# EAGLE design test_stmsize_long (EAGLE 6.6.0)
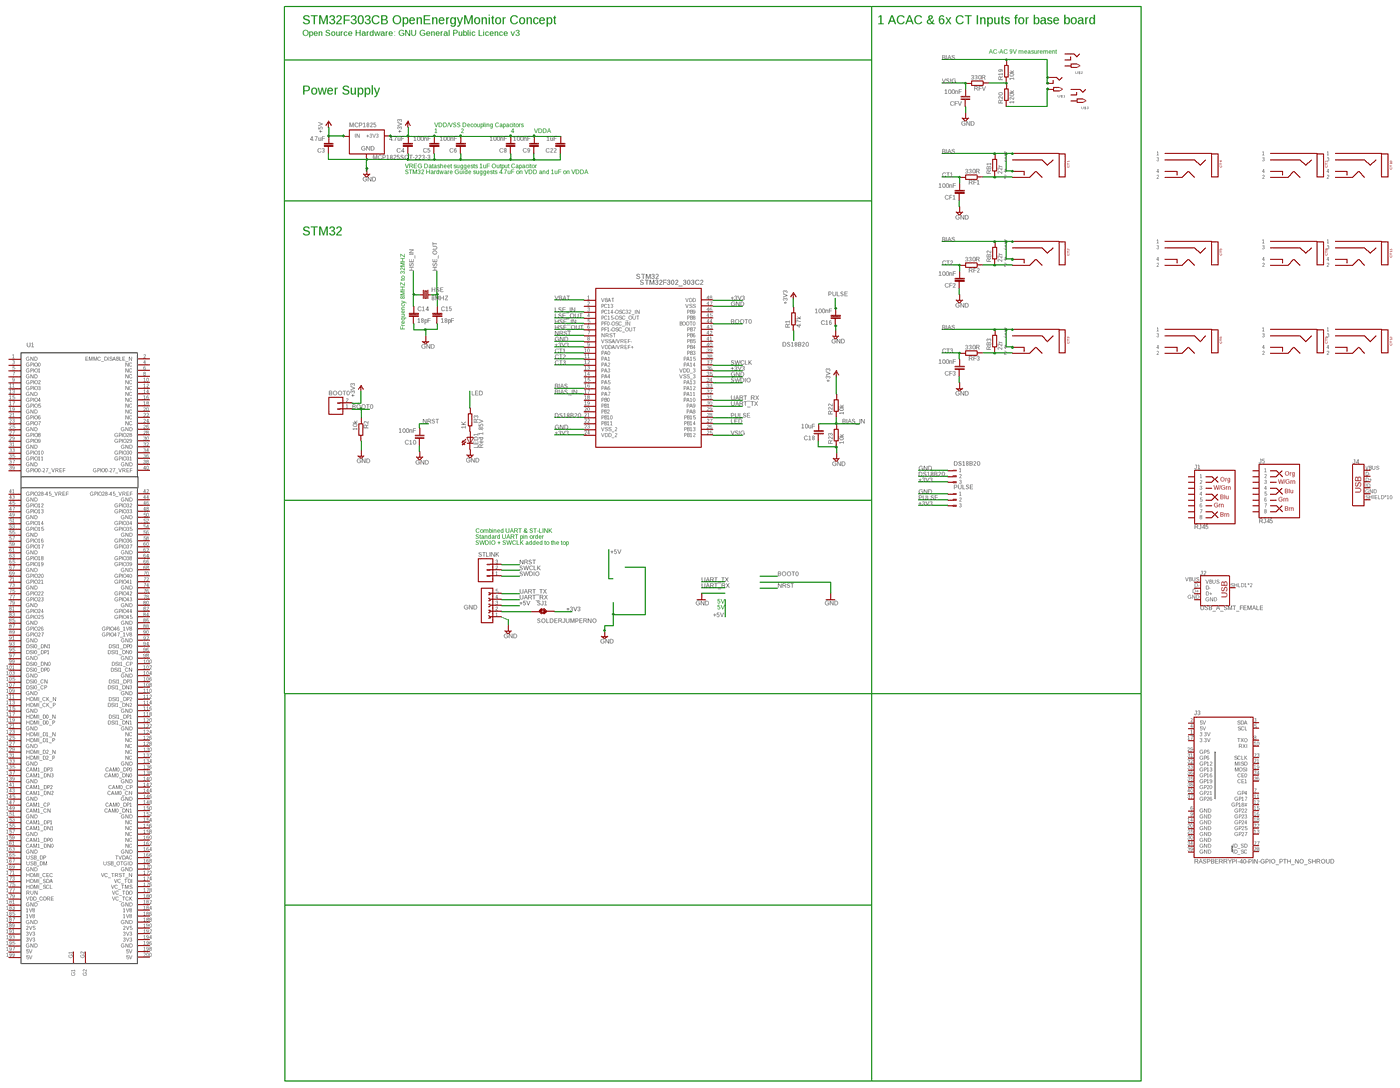
[diagram p0: schematic, sheet 1, overview]
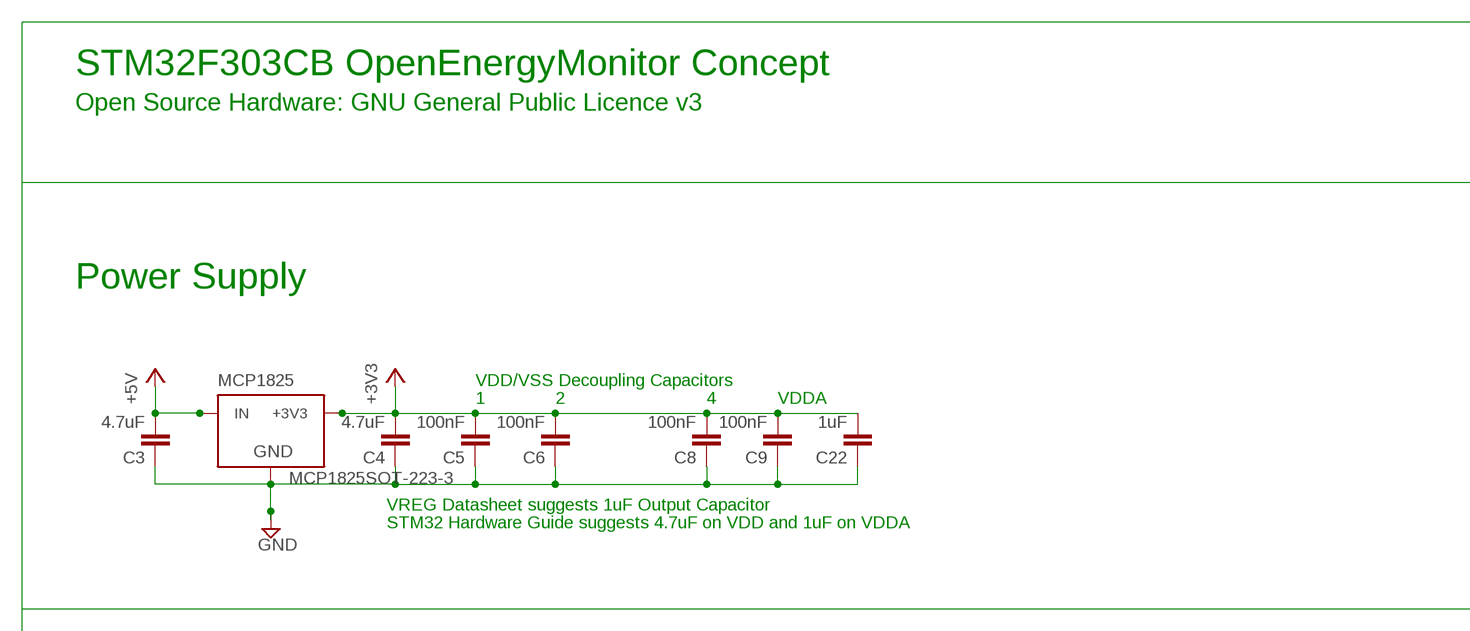
[diagram p1: schematic, sheet 1, part 1 of 4]
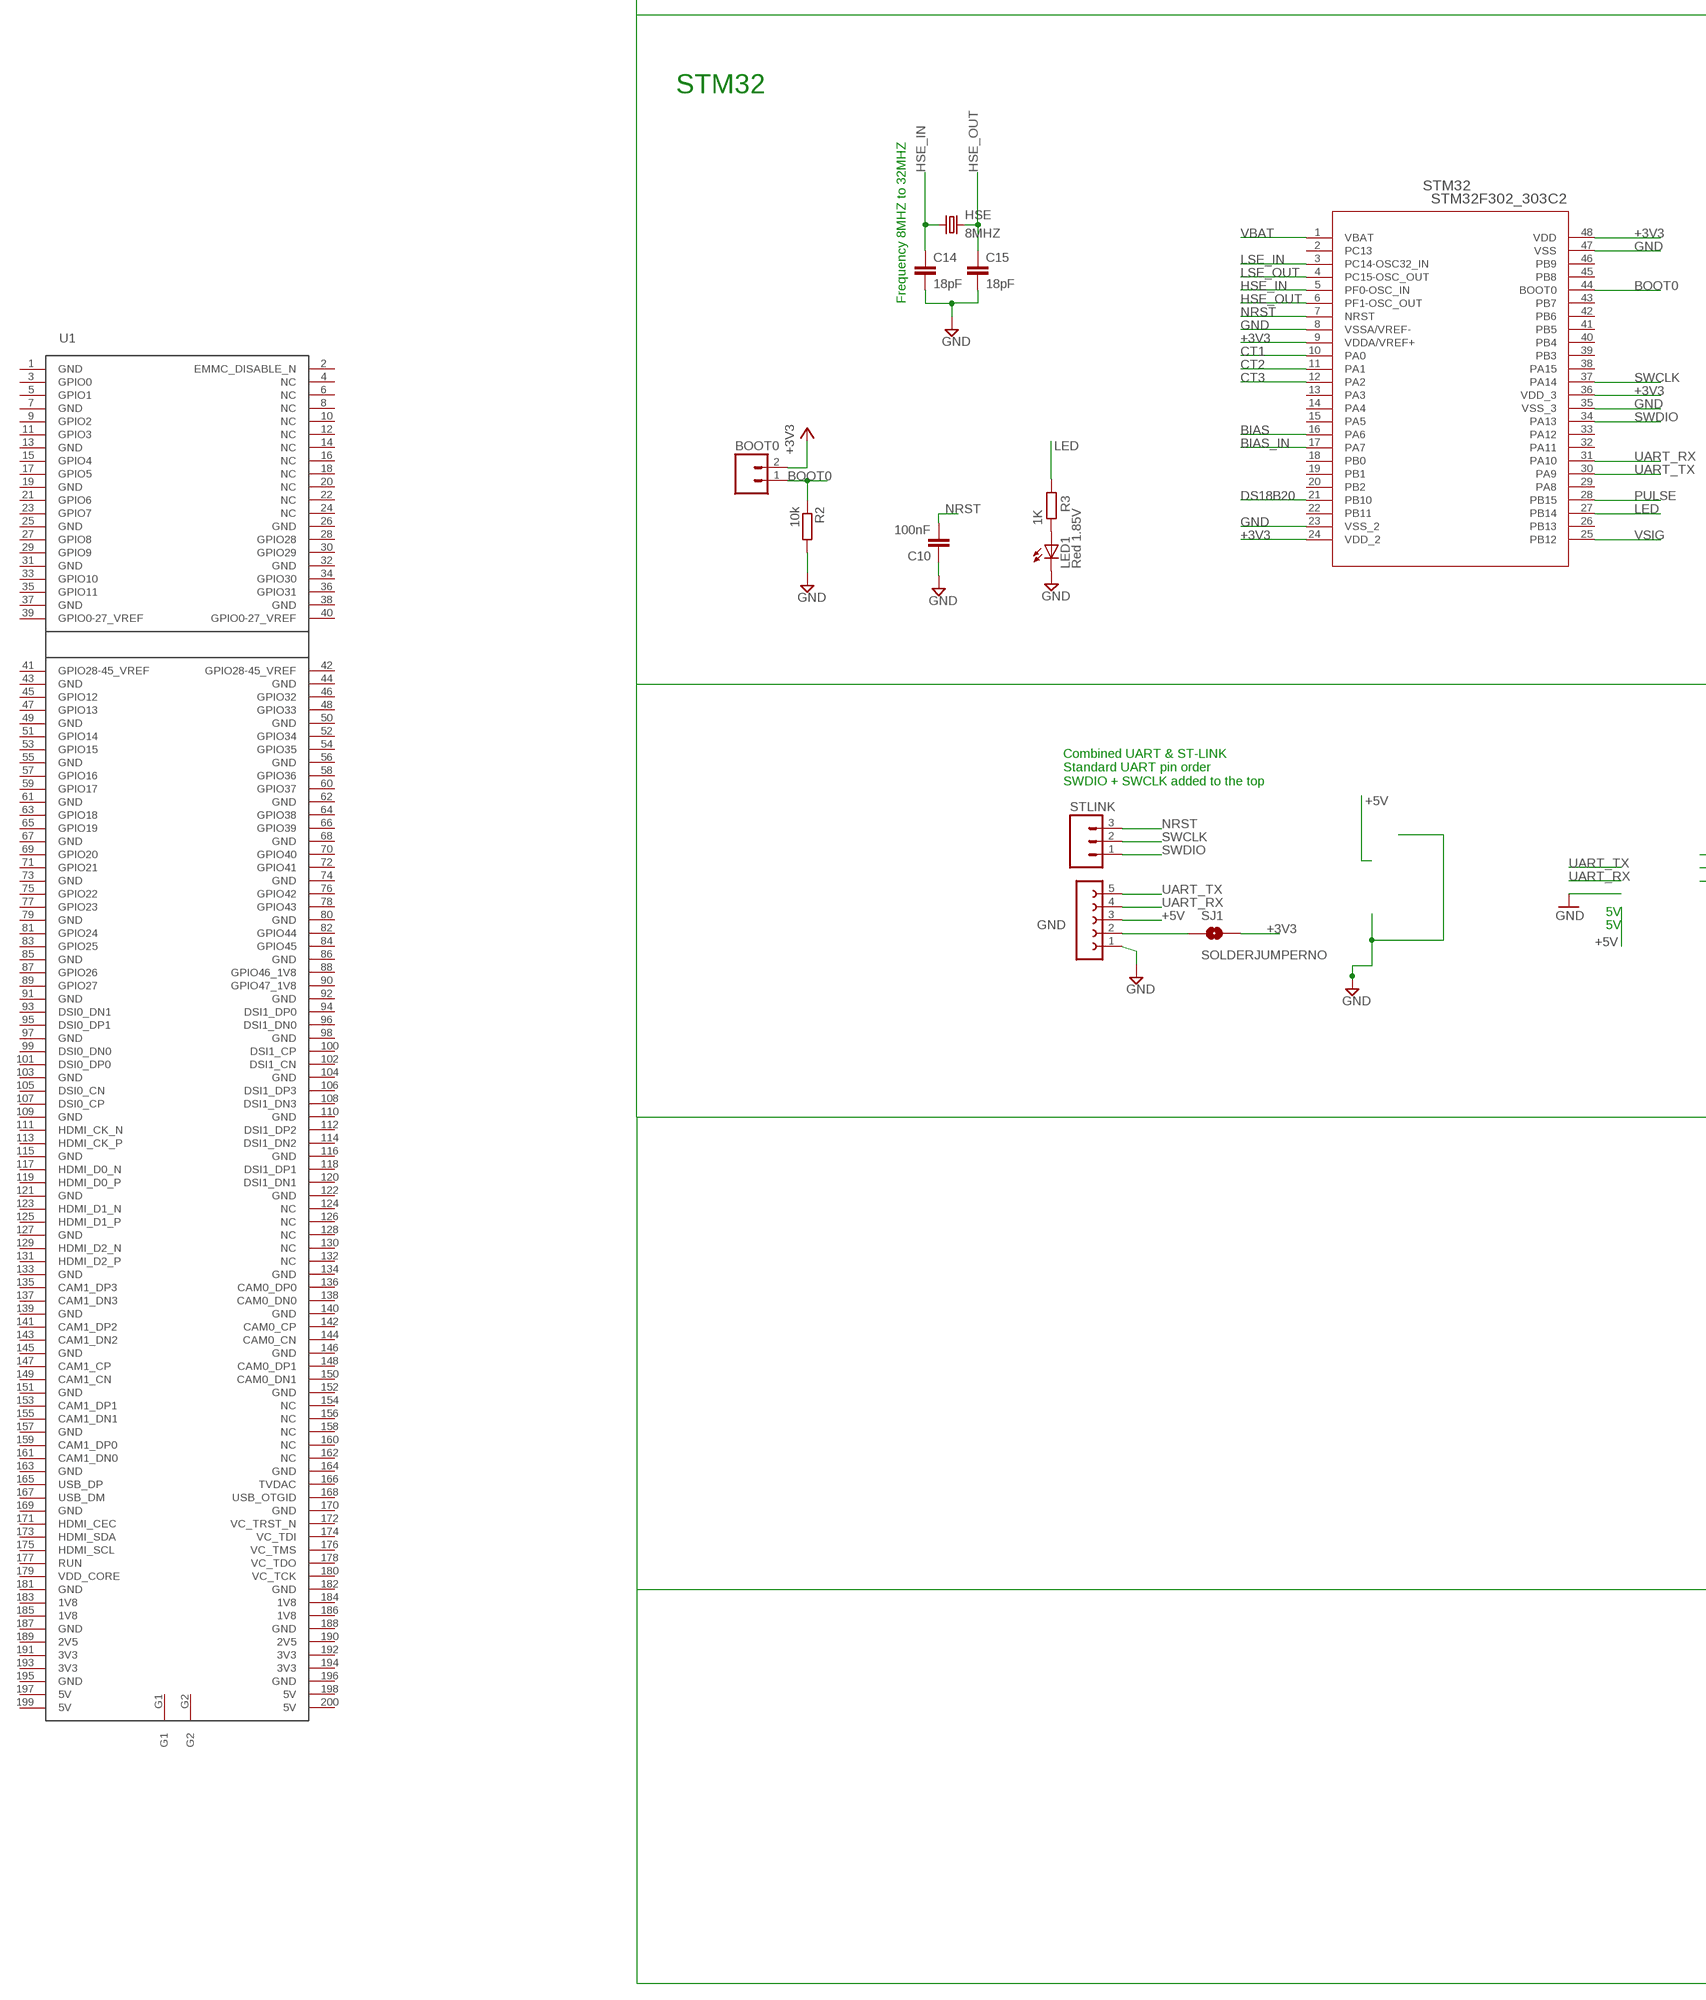
[diagram p2: schematic, sheet 1, part 2 of 4]
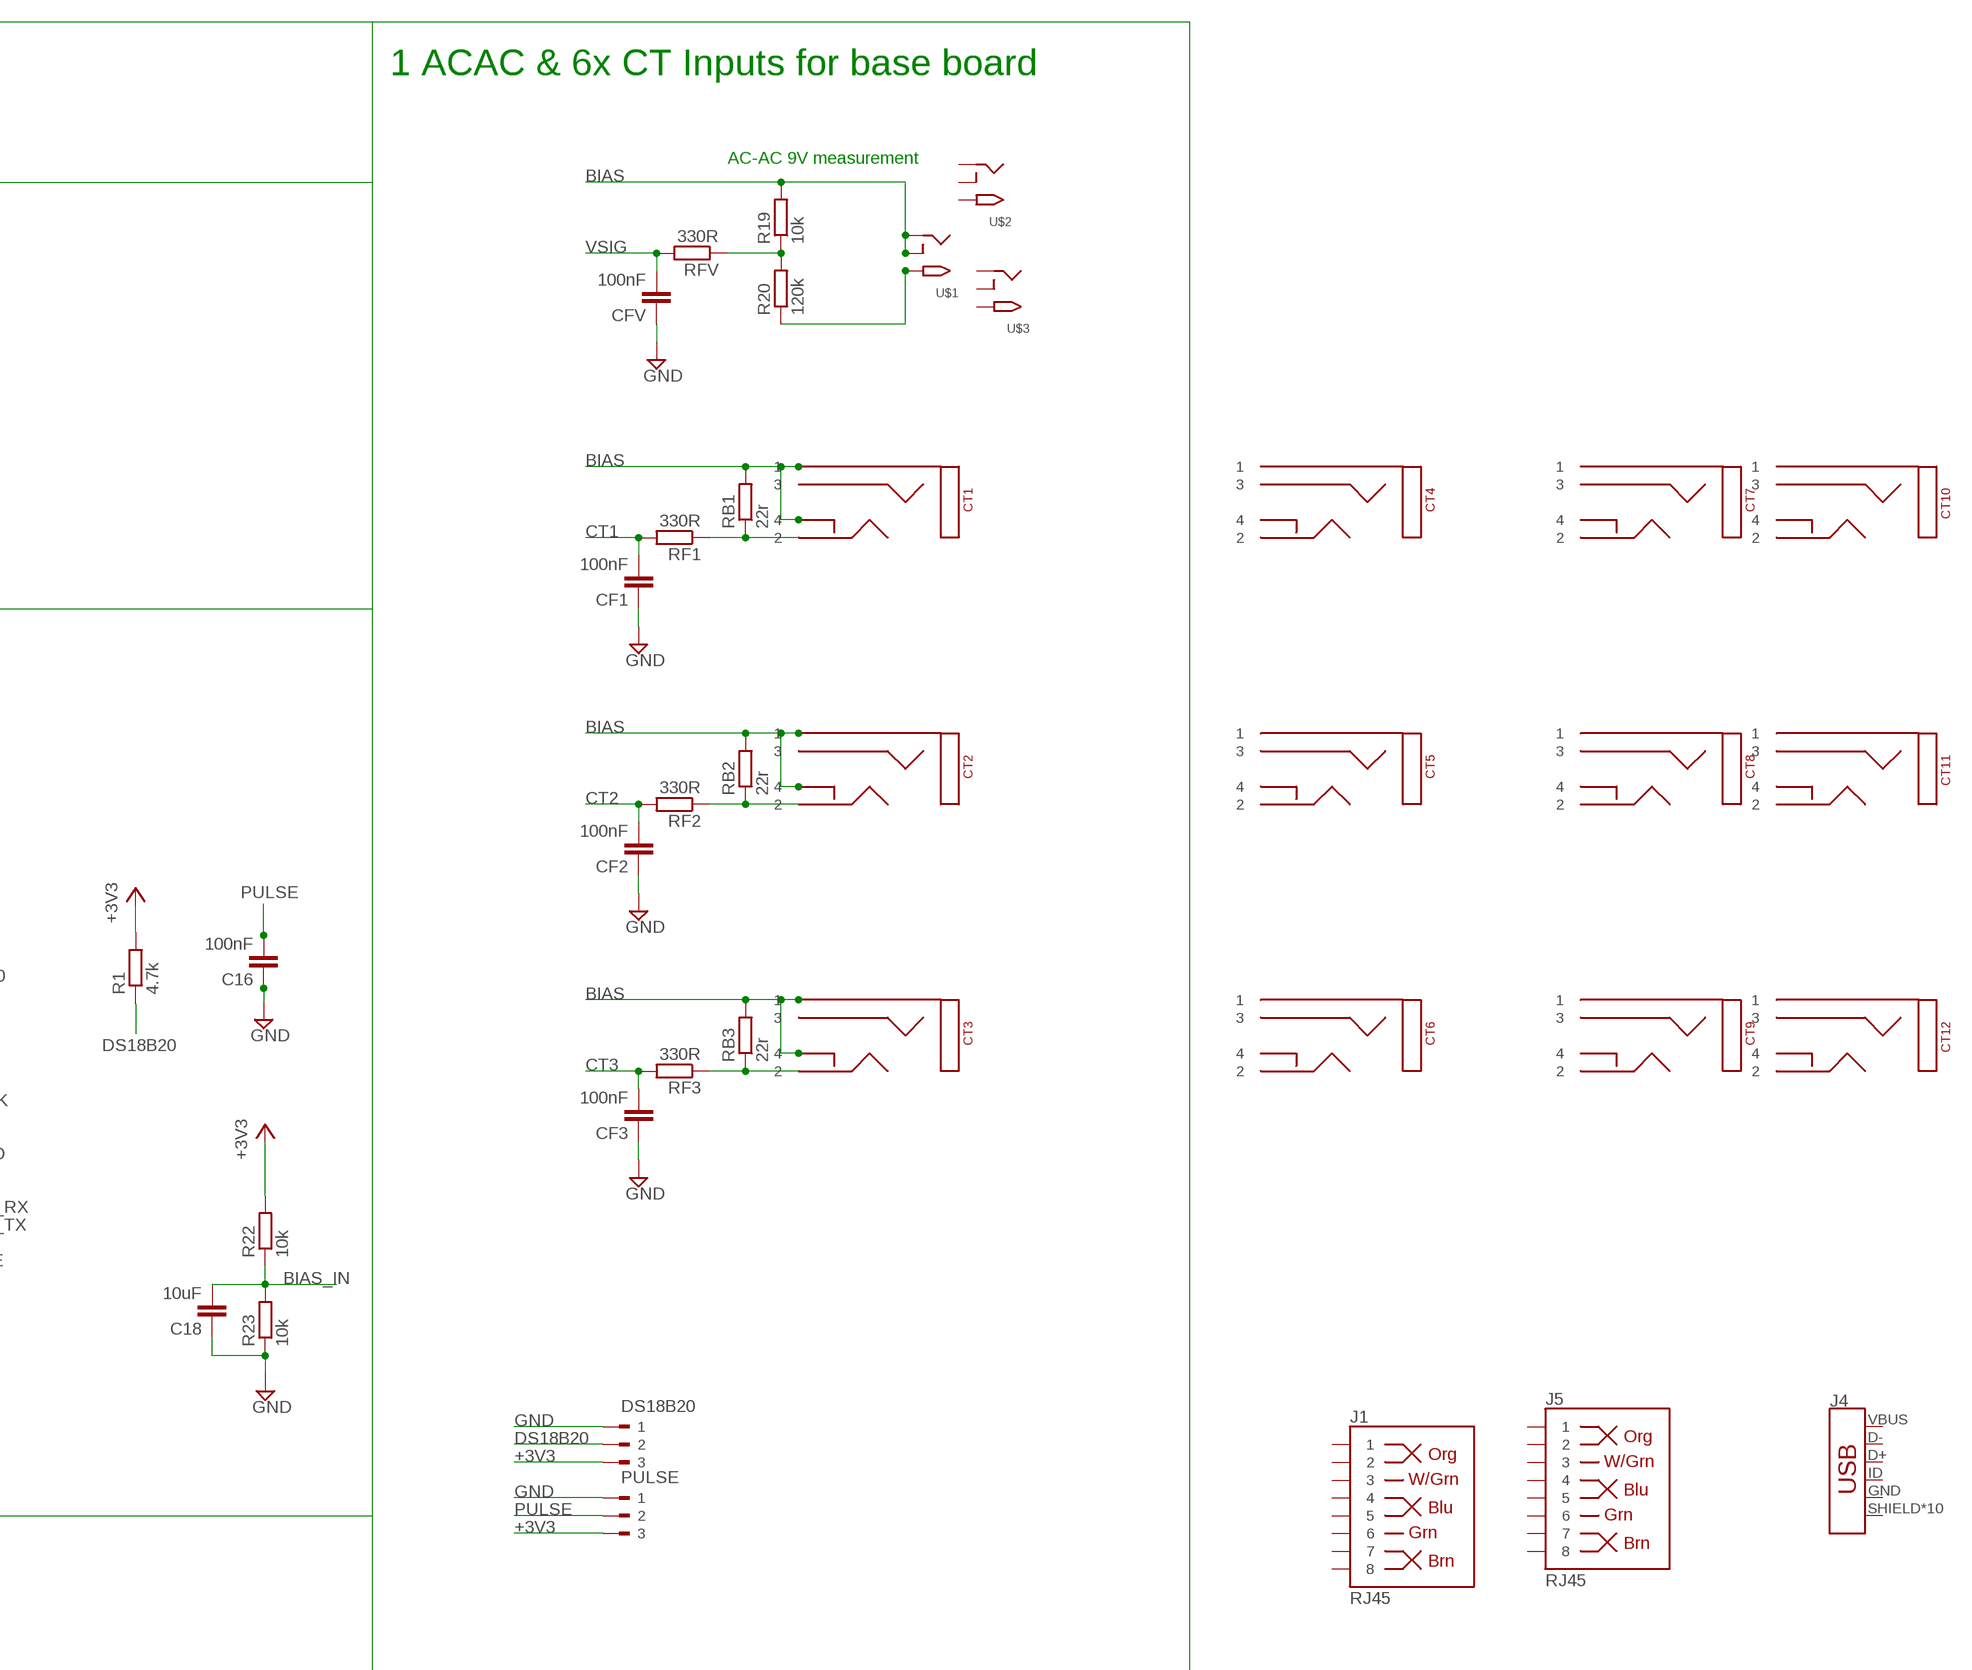
[diagram p3: schematic, sheet 1, part 3 of 4]
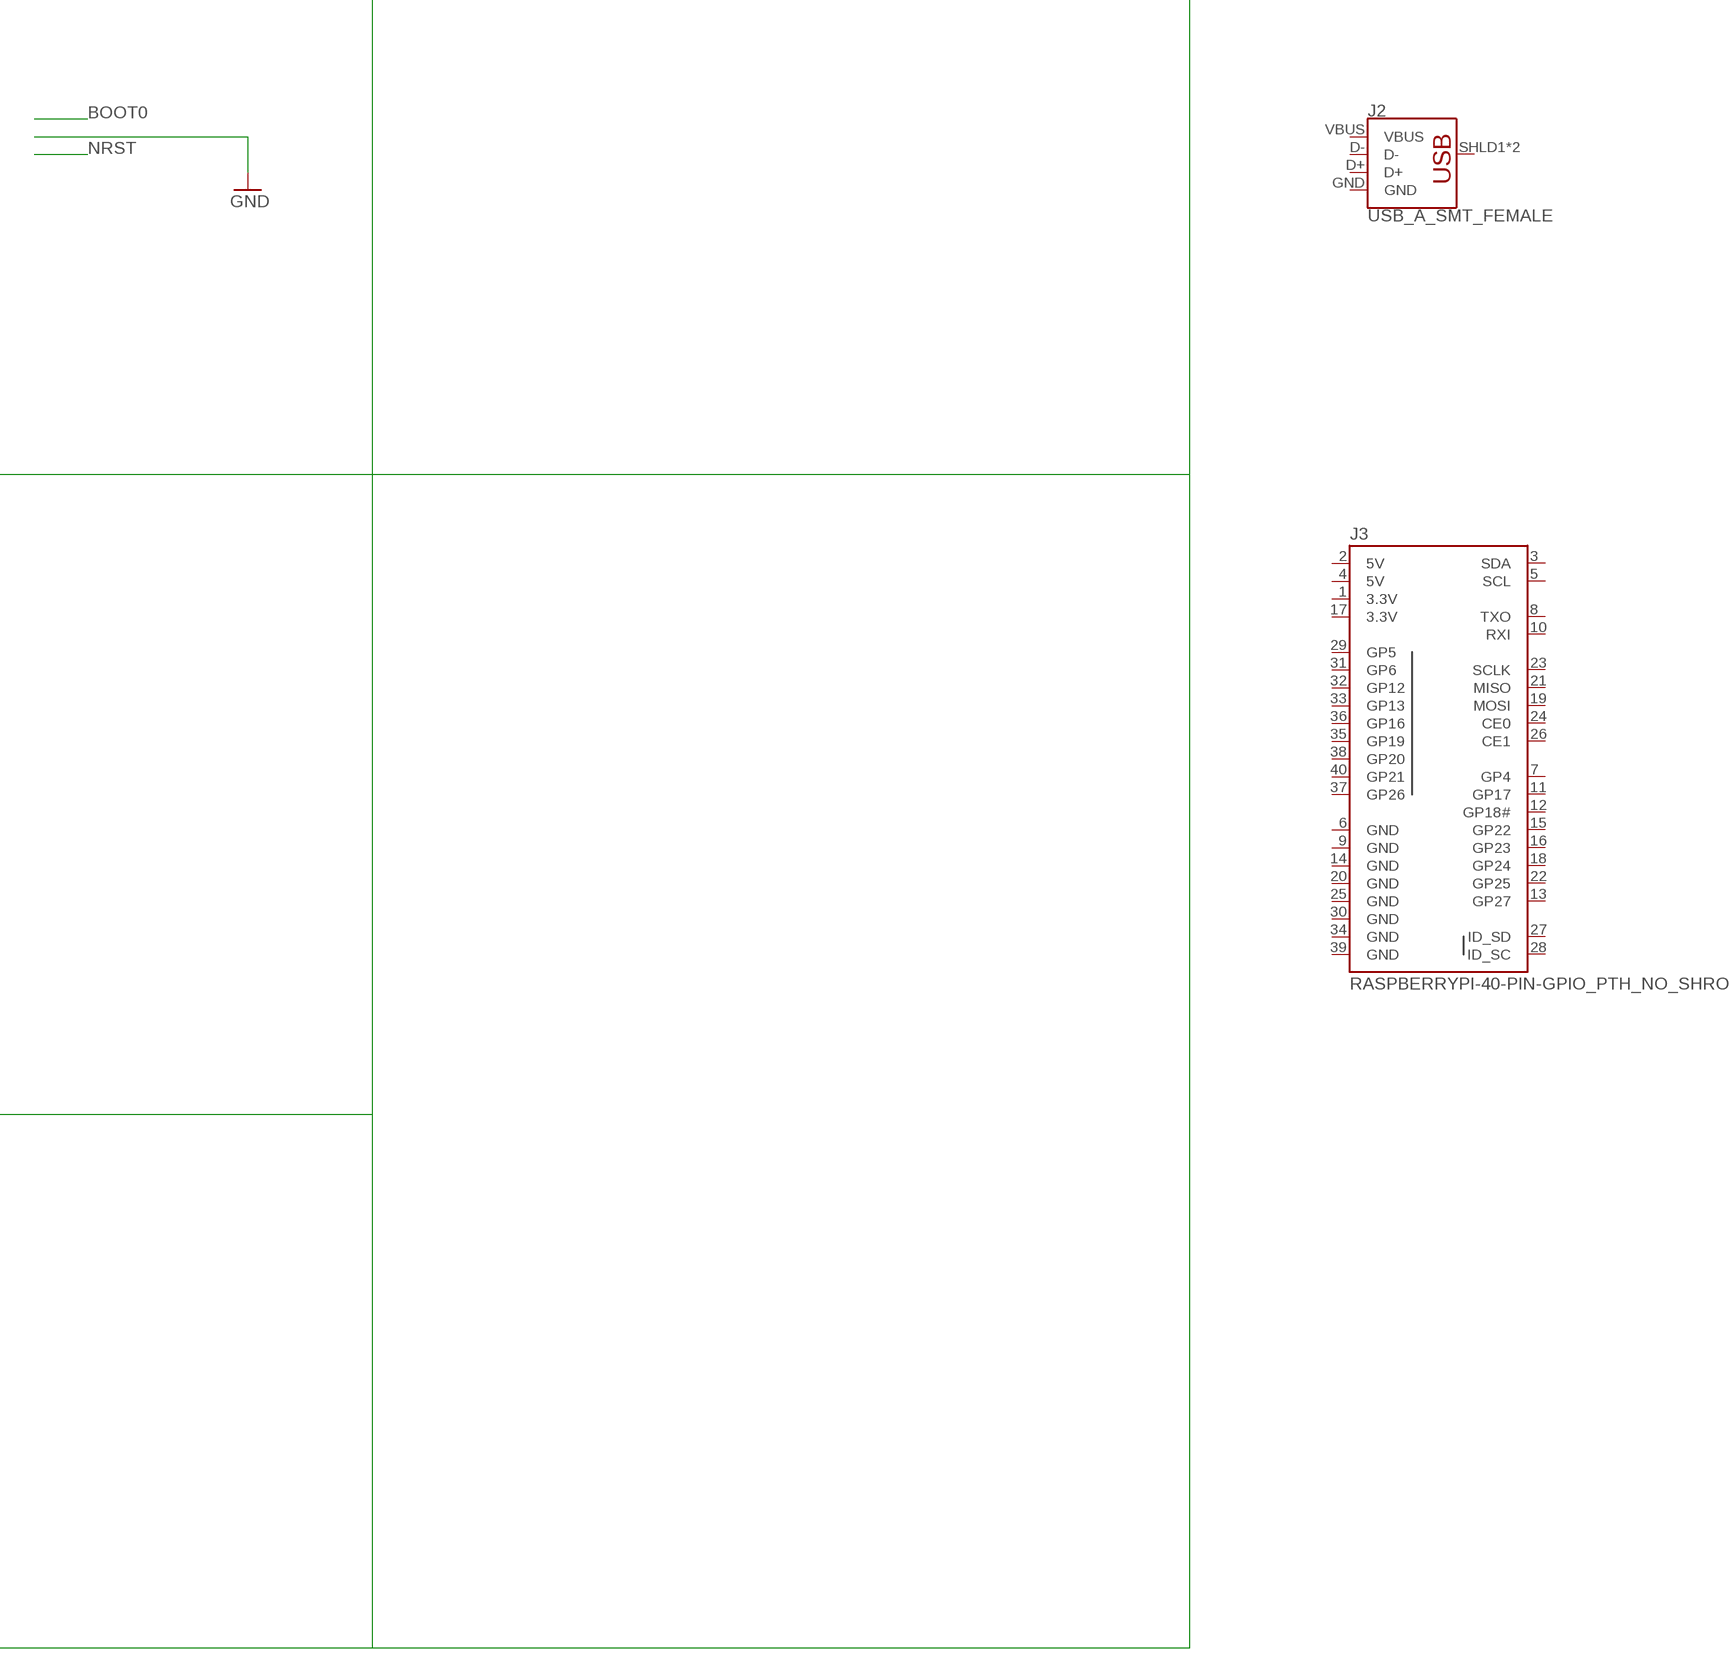
[diagram p4: schematic, sheet 1, part 4 of 4]

## Parts
BOOT0  M02PTH  [1X02]
C3  4.7uF  C-EUC0603  [C0603]
C4  4.7uF  C-EUC0603  [C0603]
C5  100nF  C-EUC0603  [C0603]
C6  100nF  C-EUC0603  [C0603]
C8  100nF  C-EUC0603  [C0603]
C9  100nF  C-EUC0603  [C0603]
C10  100nF  C-EUC0603  [C0603]
C14  18pF  C-EUC0603  [C0603]
C15  18pF  C-EUC0603  [C0603]
C16  100nF  C-EUC0603  [C0603]
C18  10uF  C-EUC0603  [C0603]
C22  1uF  C-EUC0603  [C0603]
CF1  100nF  C-EUC0603  [C0603]
CF2  100nF  C-EUC0603  [C0603]
CF3  100nF  C-EUC0603  [C0603]
CFV  100nF  C-EUC0603  [C0603]
CT1  STEREO_SMD  [STEREO_SMT]
CT2  STEREO_SMD  [STEREO_SMT]
CT3  STEREO_SMD  [STEREO_SMT]
CT4  STEREO_SMD  [STEREO_SMT]
CT5  STEREO_SMD  [STEREO_SMT]
CT6  STEREO_SMD  [STEREO_SMT]
CT7  STEREO_SMD  [STEREO_SMT]
CT8  STEREO_SMD  [STEREO_SMT]
CT9  STEREO_SMD  [STEREO_SMT]
CT10  STEREO_SMD  [STEREO_SMT]
CT11  STEREO_SMD  [STEREO_SMT]
CT12  STEREO_SMD  [STEREO_SMT]
DS18B20  180-3  [180-3]
GND  UART  FE05-1  [FE05-1]
HSE  8MHZ  CRYSTALCTS406  [CTS406]
J1  RJ45  RJ45-8  [RJ45-8]
J2  USB_A_SMT_FEMALE  [USB-A-S-SILK-FEMALE]
J3  RASPBERRYPI-40-PIN-GPIO_PTH_NO_SHROUD  [2X20]
J4  USB_MICRO-B_HALF_PTH_MILL  [USB-MICROB-PTH-MILL]
J5  RJ45  RJ45-8  [RJ45-8]
LED1  Red 1.85V  LEDCHIP-LED0805  [CHIP-LED0805]
MCP1825  MCP1825SOT-223-3  [SOT-223]
PULSE  180-3  [180-3]
R1  4.7k  R-EU_R0603  [R0603]
R2  10k  R-EU_R0603  [R0603]
R3  1K  R-EU_R0603  [R0603]
R19  10k  R-EU_R0603  [R0603]
R20  120k  R-EU_R0603  [R0603]
R22  10k  R-EU_R0603  [R0603]
R23  10k  R-EU_R0603  [R0603]
RB1  22r  R-EU_R0603  [R0603]
RB2  22r  R-EU_R0603  [R0603]
RB3  22r  R-EU_R0603  [R0603]
RF1  330R  R-EU_R0603  [R0603]
RF2  330R  R-EU_R0603  [R0603]
RF3  330R  R-EU_R0603  [R0603]
RFV  330R  R-EU_R0603  [R0603]
SJ1  SOLDERJUMPERNO  [SJ_2S-NO]
STLINK  M03PTH  [1X03]
STM32  STM32F302_303C2  [LQFP48-7X7MM]
U1  COMPUTE_MODULE  [SO-DIMM]
U$1  2.1MMJACKSMT  [DCJACK_2MM_SMT]
U$2  2.1MMJACKSMT  [DCJACK_2MM_SMT]
U$3  2.1MMJACKSMT  [DCJACK_2MM_SMT]

## Nets
+3V3: BOOT0.2 C4.2 C5.2 C6.2 C8.2 C9.2 C22.2 DS18B20.3 MCP1825.3(+3V3) PULSE.3 R1.2 R22.2 SJ1.2 STM32.9(VDDA/VREF+) STM32.24(VDD_2) STM32.36(VDD_3) STM32.48(VDD)
+5V: C3.2 GND.3 MCP1825.1(IN)
AC: R20.1 U$1.PWR2(TIP)
ADC0: R19.1 R20.2 RFV.1
BIAS: CT1.P$1 CT1.P$4 CT2.P$1 CT2.P$4 CT3.P$1 CT3.P$4 R19.2 RB1.2 RB2.2 RB3.2 STM32.16(PA6) U$1.GND(RING) U$1.GNDBREAK(RING_SW)
BIAS_IN: C18.2 R22.1 R23.2 STM32.17(PA7)
BOOT0: BOOT0.1 R2.1 STM32.44(BOOT0)
CT1: CF1.2 RF1.2 STM32.10(PA0)
CT2: CF2.2 RF2.2 STM32.11(PA1)
CT3: CF3.2 RF3.2 STM32.12(PA2)
DS18B20: DS18B20.2 R1.1 STM32.21(PB10)
GND: C3.1 C4.1 C5.1 C6.1 C8.1 C9.1 C10.1 C14.2 C15.2 C16.1 C18.1 C22.1 CF1.1 CF2.1 CF3.1 CFV.1 DS18B20.1 GND.1 LED1.C MCP1825.2(GND) PULSE.1 R2.2 R23.1 STM32.8(VSSA/VREF-) STM32.23(VSS_2) STM32.35(VSS_3) STM32.47(VSS)
HSE_IN: C14.1 HSE.1 STM32.5(PF0-OSC_IN)
HSE_OUT: C15.1 HSE.3 STM32.6(PF1-OSC_OUT)
LED: R3.2 STM32.27(PB14)
LSE_IN: STM32.3(PC14-OSC32_IN)
LSE_OUT: STM32.4(PC15-OSC_OUT)
N$1: GND.2 SJ1.1
N$2: CT1.P$2 RB1.1 RF1.1
N$8: CT2.P$2 RB2.1 RF2.1
N$10: CT3.P$2 RB3.1 RF3.1
N$41: LED1.A R3.1
NRST: C10.2 STLINK.3 STM32.7(NRST)
PULSE: C16.2 PULSE.2 STM32.28(PB15)
SWCLK: STLINK.2 STM32.37(PA14)
SWDIO: STLINK.1 STM32.34(PA13)
UART_RX: GND.4 STM32.31(PA10)
UART_TX: GND.5 STM32.30(PA9)
VBAT: STM32.1(VBAT)
VSIG: CFV.2 RFV.2 STM32.25(PB12)
Unconnected: CT1.P$3 CT2.P$3 CT3.P$3 CT4.P$1 CT4.P$2 CT4.P$3 CT4.P$4 CT5.P$1 CT5.P$2 CT5.P$3 CT5.P$4 CT6.P$1 CT6.P$2 CT6.P$3 CT6.P$4 CT7.P$1 CT7.P$2 CT7.P$3 CT7.P$4 CT8.P$1 CT8.P$2 CT8.P$3 CT8.P$4 CT9.P$1 CT9.P$2 CT9.P$3 CT9.P$4 CT10.P$1 CT10.P$2 CT10.P$3 CT10.P$4 CT11.P$1 CT11.P$2 CT11.P$3 CT11.P$4 CT12.P$1 CT12.P$2 CT12.P$3 CT12.P$4 J1.1 J1.2 J1.3 J1.4 J1.5 J1.6 J1.7 J1.8 J2.D+ J2.D- J2.SHLD1(SHIELD) J2.SHLD2(SHIELD) J3.3(SDA) J3.5(SCL) J3.7(GP4) J3.8(TXO) J3.10(RXI) J3.11(GP17) J3.12(GP18#) J3.13(GP27) J3.15(GP22) J3.16(GP23) J3.18(GP24) J3.19(MOSI) J3.21(MISO) J3.22(GP25) J3.23(SCLK) J3.24(CE0) J3.26(CE1) J3.27(ID_SD) J3.28(ID_SC) J3.29(GP5) J3.31(GP6) J3.32(GP12) J3.33(GP13) J3.35(GP19) J3.36(GP16) J3.37(GP26) J3.38(GP20) J3.40(GP21) J4.D+ J4.D- J4.ID J4.SHIELD J4.SHIELD2(SHIELD) J4.SHIELD3(SHIELD) J4.SHIELD4(SHIELD) J4.SHIELD5(SHIELD) J4.SHIELD6(SHIELD) J4.SHIELD7(SHIELD) J4.SHIELD8(SHIELD) J4.SHIELD9(SHIELD) J4.SHIELD10(SHIELD) J5.1 J5.2 J5.3 J5.4 J5.5 J5.6 J5.7 J5.8 STM32.2(PC13) STM32.13(PA3) STM32.14(PA4) STM32.15(PA5) STM32.18(PB0) STM32.19(PB1) STM32.20(PB2) STM32.22(PB11) STM32.26(PB13) STM32.29(PA8) STM32.32(PA11) STM32.33(PA12) STM32.38(PA15) STM32.39(PB3) STM32.40(PB4) STM32.41(PB5) STM32.42(PB6) STM32.43(PB7) STM32.45(PB8) STM32.46(PB9) U1.1(GND) U1.2(EMMC_DISABLE_N) U1.3(GPIO0) U1.4(NC) U1.5(GPIO1) U1.6(NC) U1.7(GND) U1.8(NC) U1.9(GPIO2) U1.10(NC) U1.11(GPIO3) U1.12(NC) U1.13(GND) U1.14(NC) U1.15(GPIO4) U1.16(NC) U1.17(GPIO5) U1.18(NC) U1.19(GND) U1.20(NC) U1.21(GPIO6) U1.22(NC) U1.23(GPIO7) U1.24(NC) U1.25(GND) U1.26(GND) U1.27(GPIO8) U1.28(GPIO28) U1.29(GPIO9) U1.30(GPIO29) U1.31(GND) U1.32(GND) U1.33(GPIO10) U1.34(GPIO30) U1.35(GPIO11) U1.36(GPIO31) U1.37(GND) U1.38(GND) U1.39(GPIO0-27_VREF) U1.40(GPIO0-27_VREF) U1.41(GPIO28-45_VREF) U1.42(GPIO28-45_VREF) U1.43(GND) U1.44(GND) U1.45(GPIO12) U1.46(GPIO32) U1.47(GPIO13) U1.48(GPIO33) U1.49(GND) U1.50(GND) U1.51(GPIO14) U1.52(GPIO34) U1.53(GPIO15) U1.54(GPIO35) U1.55(GND) U1.56(GND) U1.57(GPIO16) U1.58(GPIO36) U1.59(GPIO17) U1.60(GPIO37) U1.61(GND) U1.62(GND) U1.63(GPIO18) U1.64(GPIO38) U1.65(GPIO19) U1.66(GPIO39) U1.67(GND) U1.68(GND) U1.69(GPIO20) U1.70(GPIO40) U1.71(GPIO21) U1.72(GPIO41) U1.73(GND) U1.74(GND) U1.75(GPIO22) U1.76(GPIO42) U1.77(GPIO23) U1.78(GPIO43) U1.79(GND) U1.80(GND) U1.81(GPIO24) U1.82(GPIO44) U1.83(GPIO25) U1.84(GPIO45) U1.85(GND) U1.86(GND) U1.87(GPIO26) U1.88(GPIO46_1V8) U1.89(GPIO27) U1.90(GPIO47_1V8) U1.91(GND) U1.92(GND) U1.93(DSI0_DN1) U1.94(DSI1_DP0) U1.95(DSI0_DP1) U1.96(DSI1_DN0) U1.97(GND) U1.98(GND) U1.99(DSI0_DN0) U1.100(DSI1_CP) U1.101(DSI0_DP0) U1.102(DSI1_CN) U1.103(GND) U1.104(GND) U1.105(DSI0_CN) U1.106(DSI1_DP3) U1.107(DSI0_CP) U1.108(DSI1_DN3) U1.109(GND) U1.110(GND) U1.111(HDMI_CK_N) U1.112(DSI1_DP2) U1.113(HDMI_CK_P) U1.114(DSI1_DN2) U1.115(GND) U1.116(GND) U1.117(HDMI_D0_N) U1.118(DSI1_DP1) U1.119(HDMI_D0_P) U1.120(DSI1_DN1) U1.121(GND) U1.122(GND) U1.123(HDMI_D1_N) U1.124(NC) U1.125(HDMI_D1_P) U1.126(NC) U1.127(GND) U1.128(NC) U1.129(HDMI_D2_N) U1.130(NC) U1.131(HDMI_D2_P) U1.132(NC) U1.133(GND) U1.134(GND) U1.135(CAM1_DP3) U1.136(CAM0_DP0) U1.137(CAM1_DN3) U1.138(CAM0_DN0) U1.139(GND) U1.140(GND) U1.141(CAM1_DP2) U1.142(CAM0_CP) U1.143(CAM1_DN2) U1.144(CAM0_CN) U1.145(GND) U1.146(GND) U1.147(CAM1_CP) U1.148(CAM0_DP1) U1.149(CAM1_CN) U1.150(CAM0_DN1) U1.151(GND) U1.152(GND) U1.153(CAM1_DP1) U1.154(NC) U1.155(CAM1_DN1) U1.156(NC) U1.157(GND) U1.158(NC) U1.159(CAM1_DP0) U1.160(NC) U1.161(CAM1_DN0) U1.162(NC) U1.163(GND) U1.164(GND) U1.165(USB_DP) U1.166(TVDAC) U1.167(USB_DM) U1.168(USB_OTGID) U1.169(GND) U1.170(GND) U1.171(HDMI_CEC) U1.172(VC_TRST_N) U1.173(HDMI_SDA) U1.174(VC_TDI) U1.175(HDMI_SCL) U1.176(VC_TMS) U1.177(RUN) U1.178(VC_TDO) U1.179(VDD_CORE) U1.180(VC_TCK) U1.181(GND) U1.182(GND) U1.183(1V8) U1.184(1V8) U1.185(1V8) U1.186(1V8) U1.187(GND) U1.188(GND) U1.189(2V5) U1.190(2V5) U1.191(3V3) U1.192(3V3) U1.193(3V3) U1.194(3V3) U1.195(GND) U1.196(GND) U1.197(5V) U1.198(5V) U1.199(5V) U1.200(5V) U1.G1 U1.G2 U$2.GND(RING) U$2.GNDBREAK(RING_SW) U$2.PWR2(TIP) U$3.GND(RING) U$3.GNDBREAK(RING_SW) U$3.PWR2(TIP)

## Notes on the sheet
- STM32F303CB OpenEnergyMonitor Concept | 1 ACAC & 6x CT Inputs for base board
- Open Source Hardware: GNU General Public Licence v3
- AC-AC 9V measurement
- Power Supply
- VDD/VSS Decoupling Capacitors
- 1 | 2 | 4 | VDDA
- VREG Datasheet suggests 1uF Output Capacitor
- STM32 Hardware Guide suggests 4.7uF on VDD and 1uF on VDDA
- STM32
- Frequency 8MHZ to 32MHZ
- Combined UART & ST-LINK
  Standard UART pin order
  SWDIO + SWCLK added to the top
- 5V
- 5V

## Power pins joined to a net without a drawn wire
3.3V: J3.1(3.3V) J3.17(3.3V)
5V: J3.2(5V) J3.4(5V)
GND: J2.GND J3.6(GND) J3.9(GND) J3.14(GND) J3.20(GND) J3.25(GND) J3.30(GND) J3.34(GND) J3.39(GND) J4.GND
VBUS: J2.VBUS J4.VBUS

## Library data of the parts
BOOT0 = SparkFun:M02: Header 2 Standard 2-pin 0.1" header. Use with straight break away headers (SKU : PRT-00116), right angle break away headers (PRT-00553), swiss pins (PRT-00743), machine pins (PRT-00117), and female headers (PRT-00115). Molex polarized connector foot print use with SKU : PRT-08233 with associated crimp pins and housings.
C3-C6 C8-C10 C14-C16 C18 C22 CF1-CF3 CFV = resistor:C-EU: CAPACITOR, European symbol
CT1-CT12 = IotaWatt_parts:STEREO_SMD: 3.5mm Stereo Jack SMT
DS18B20 PULSE = con-weidmueller-sl35:180-3: WEIDMUELLER CLAMP CONNECTOR; OC_FARNELL: unknown; OC_NEWARK: unknown
GND = con-lsta:FE05-1: FEMALE HEADER; OC_FARNELL: unknown; OC_NEWARK: unknown
HSE = crystal:CRYSTAL: CRYSTAL; OC_FARNELL: unknown; OC_NEWARK: unknown
J1 J5 = SparkFun-Connectors:RJ45-8: RJ45 Jack - 8 pin Simple RJ45, 8-pin connection. Commonly used for Cat5, Cat5e, and Cat6 Ethernet cables. Here is the connector we sell at SparkFun: RJ45 8-Pin Connector <https://www.sparkfun.com/products/643> (PRT-00643) Datasheet <https://cdn.sparkfun.com/datasheets/Prototyping/04908.pdf> It is used on this SparkFun product: SparkFun RJ45 Breakout <https://www.sparkfun.com/products/716> (BOB-00716) Note, you may also be interested in the "MAGJACK" version of this. It is basically a RJ45 connector, but also has some status LEDs built into the connector housing. You can check that out in this library at the device named "MAGJACK.dev" and see these products online: RJ45 Ethernet MagJack-Compatible <https://www.sparkfun.com/products/8534> (PRT-08534) SparkFun RJ45 MagJack Breakout <https://www.sparkfun.com/products/13021> (BOB-13021); PROD_ID: CONN-08506; SF_ID: PRT-00643
J2 = SparkFun-Connectors:USB_A: USB-A Connector Male and female variants, as well as PTH and SMT variants SparkFun Products: SparkFun XBee Explorer Dongle <https://www.sparkfun.com/products/11697> PTH Male SparkFun MicroView-USB Programmer <https://www.sparkfun.com/products/12924> SMT Male SparkFun USB Type A Female Breakout <https://www.sparkfun.com/products/12700> SMT Female; PROD_ID: CONN-09520; SF_ID: PRT-09011
J3 = SparkFun-Connectors:RASPBERRYPI-40-PIN-GPIO: Raspberry Pi GPIO Header 2x20 pin connector, as found on B, B+, A+ models. Both shrouded PTH and SMT versions available. SparkFun Products: GPIO Shrouded Header <https://www.sparkfun.com/products/13054>- PTH SparkFun Pi Wedge (Preassembled) <https://www.sparkfun.com/products/13717>
J4 = SparkFun-Connectors:USB_MICRO-B: USB Type Micro-B Connector Male/female and PTH/SMT variants SparkFun Products: SparkFun microB USB Breakout <https://www.sparkfun.com/products/12035> SparkFun USB microB Plug Breakout <https://www.sparkfun.com/products/10031> SparkFun ESP8266 Thing <https://www.sparkfun.com/products/13231>; PROD_ID: CONN-13711
LED1 = adafruit:LED: LED OSRAM: - CHIPLED LG R971, LG N971, LY N971, LG Q971, LY Q971, LO R971, LY R971 LH N974, LH R974 LS Q976, LO Q976, LY Q976 LO Q996 - Hyper CHIPLED LW Q18S LB Q993, LB Q99A, LB R99A - SideLED LS A670, LO A670, LY A670, LG A670, LP A670 LB A673, LV A673, LT A673, LW A673 LH A674 LY A675 LS A676, LA A676, LO A676, LY A676, LW A676 LS A679, LY A679, LG A679 - Hyper Micro SIDELED® LS Y876, LA Y876, LO Y876, LY Y876 LT Y87S - SmartLED LW L88C, LW L88S LB L89C, LB L89S, LG L890 LS L89K, LO L89K, LY L89K LS L896, LA L896, LO L896, LY L896 - TOPLED LS T670, LO T670, LY T670, LG T670, LP T670 LSG T670, LSP T670, LSY T670, LOP T670, LYG T670 LG T671, LOG T671, LSG T671 LB T673, LV T673, LT T673, LW T673 LH T674 LS T676, LA T676, LO T676, LY T676, LB T676, LH T676, LSB T676, LW T676 LB T67C, LV T67C, LT T67C, LS T67K, LO T67K, LY T67K, LW E67C LS E67B, LA E67B, LO E67B, LY E67B, LB E67C, LV E67C, LT E67C LW T67C LS T679, LY T679, LG T679 LS T770, LO T770, LY T770, LG T770, LP T770 LB T773, LV T773, LT T773, LW T773 LH T774 LS E675, LA E675, LY E675, LS T675 LS T776, LA T776, LO T776, LY T776, LB T776 LHGB T686 LT T68C, LB T68C - Hyper Mini TOPLED® LB M676 - Mini TOPLED Santana® LG M470 LS M47K, LO M47K, LY M47K Source: http://www.osram.convergy.de/
MCP1825 = SteelCaveRobotics-Power:MCP1825: MCP1825 3.3v LDO Linear Regulator
R1 R2 R19 R20 R22 R23 RB1-RB3 RF1-RF3 RFV = resistor:R-EU_: RESISTOR, European symbol
R3 = rcl:R-EU_: RESISTOR, European symbol
SJ1 = SparkFun:SOLDERJUMPER: Solder Jumper Standard SMD solder jumper. Used to automate production. Two varients : Normally Open and Normally Closed are the same, but have different paste layers. NC will have a large amount of paste and should jumper during reflow.
STLINK = SparkFun:M03: Header 3 Standard 3-pin 0.1" header. Use with straight break away headers (SKU : PRT-00116), right angle break away headers (PRT-00553), swiss pins (PRT-00743), machine pins (PRT-00117), and female headers (PRT-00115). Molex polarized connector foot print use with SKU : PRT-08232 with associated crimp pins and housings.
STM32 = stm32f303cb:STM32F302_303C2; MANUFACTURER_PART_NUMBER: stm32f302_303c2; VENDOR: STMicroelectronics
U1 = raspberrypi_cm:COMPUTE_MODULE: Raspberry Pi Compute Module www.hasseb.fi
U$1-U$3 = adafruit:2.1MMJACK: 2.1mm x 5.5mm THM DC jack with internal switch. Digikey part #PJ-102A, 4UCON part #05537 2.1mm x 5.5mm SMT DC jack with internal switch. Digikey part #PJ-002A-SMT, 4UCON part #03267 By microbuilder.eu & adafruit.com

## Net classes
0 default: width 0.203 mm, drill 0.6 mm, clearance 0.203 mm
1 power: width 0.381 mm, drill 0.6 mm, clearance 0.254 mm
2 gnd: width 0.254 mm, drill 0.6 mm, clearance 0.254 mm

## Board
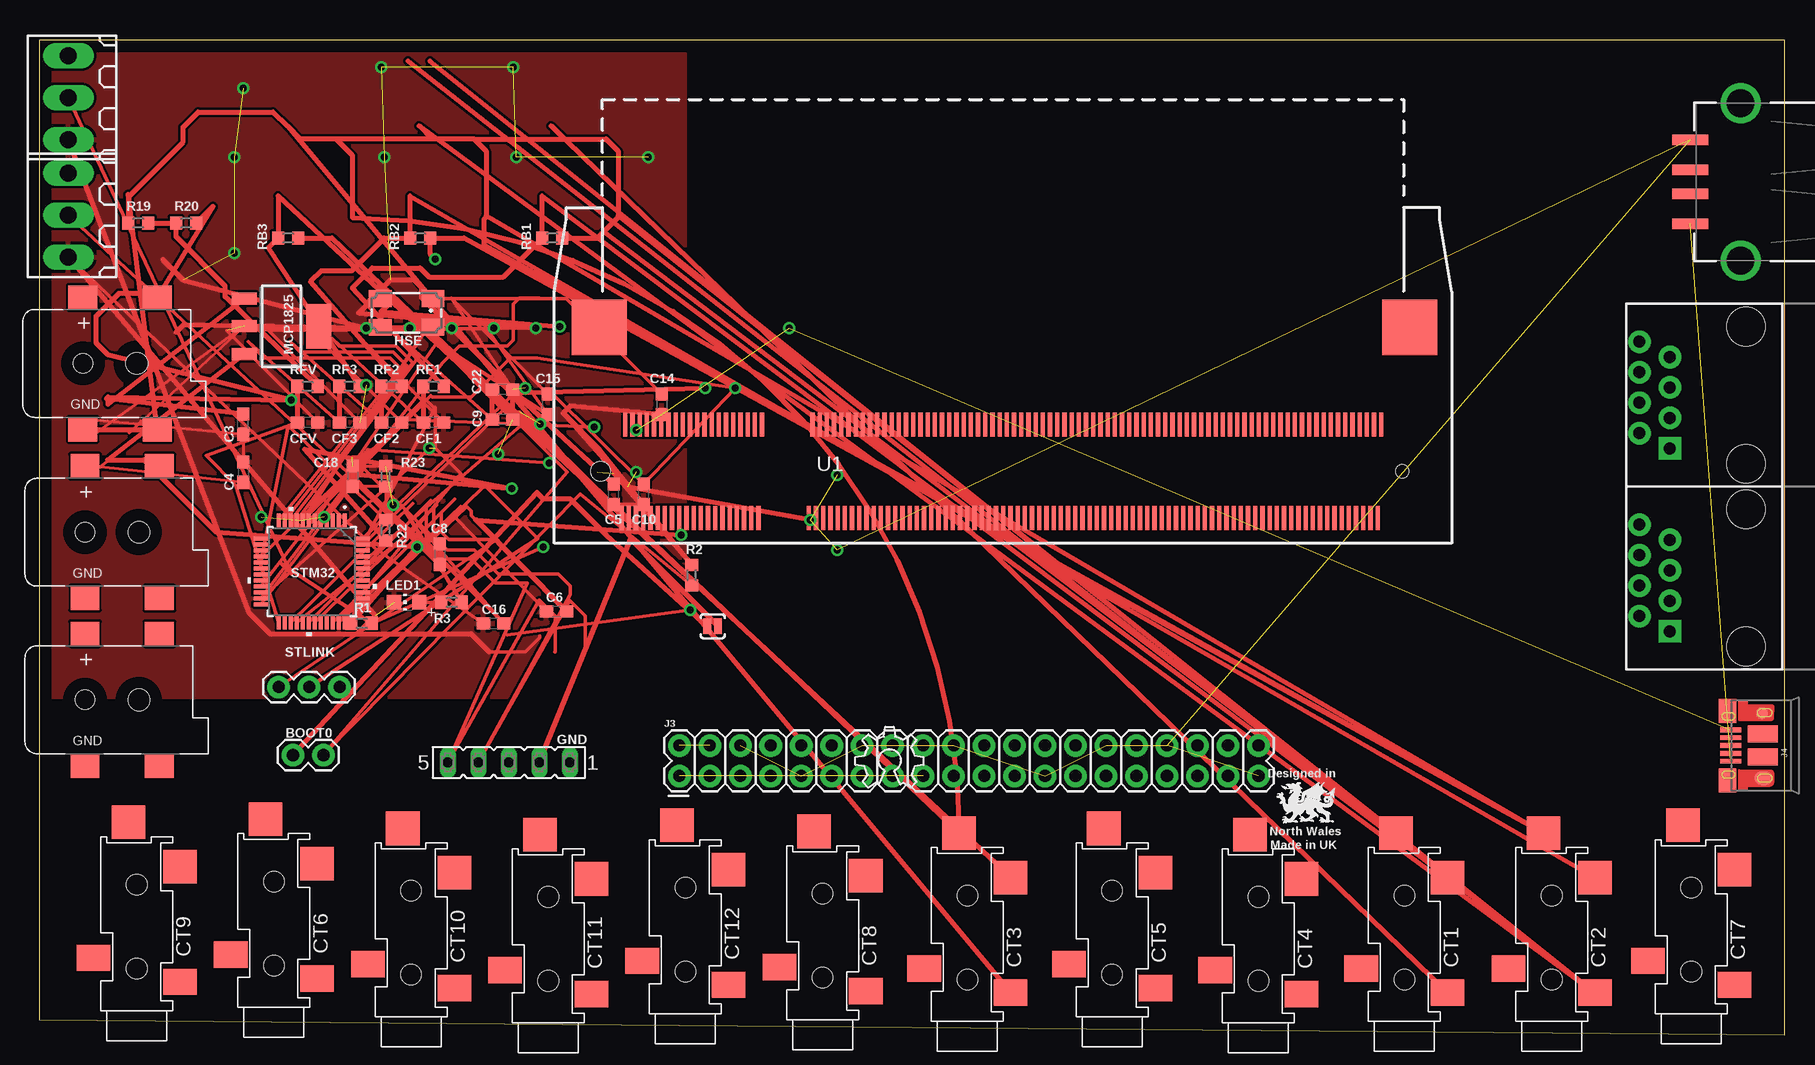
[diagram p5: board, top side]
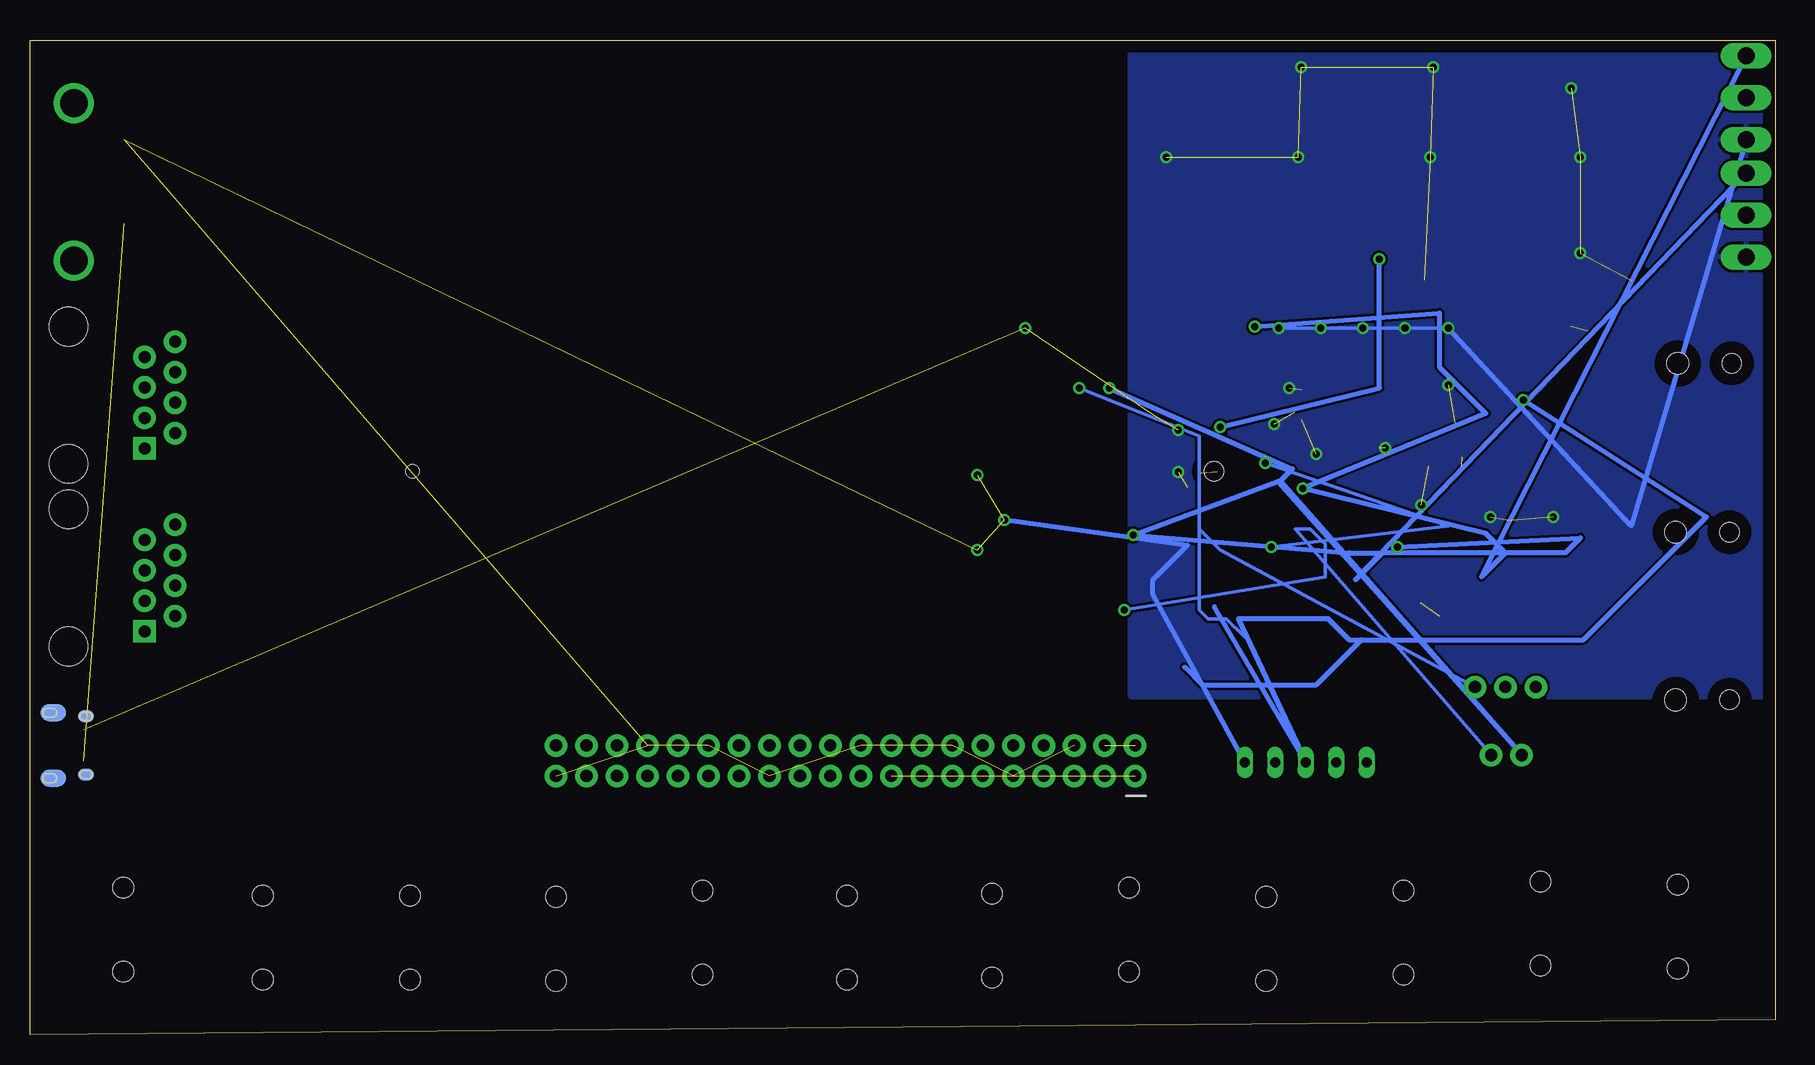
[diagram p6: board, bottom side, seen from below]

Size 145.44 x 82.94 mm. Coordinates in mm from the lower left corner, seen from the top.
Outline: 0,1.27 145.44,0 145.44,82.94 0,82.94 0,1.27
Copper layers (1*16): Top 0.035mm / dielectric 1.5mm / Bottom 0.035mm
Design rules "default *": minimum track width 10mil, minimum drill 24mil, track to track 8mil, track to pad 8mil, pad to pad 8mil, via to via 8mil, smd to smd 8mil, copper to edge 40mil, drill to drill 8mil, minimum pad ring 10mil, minimum via ring 8mil, stop-mask expansion 4mil, vias tented up to drill 0.6mm, thermal gap 10mil

### Footprints (pad centres in the part's own frame; a part is rotated, then mirrored left to right if it is on the bottom)
1X02 = drill 1.016 pad 1.88: 1 0,0; 2 2.54,0
C0603 = smd 1.1 x 1: 1 -0.85,0; 2 0.85,0
STEREO_SMT = smd 2.8 x 2.2: P$1 -3.6,-2.4; P$3 3.6,-4.4 | smd 2.8 x 2.8: P$2 -3.6,-12; P$4 0.7,-15.7 | hole 1.7: 0,-3.5; 0,-10.5
180-3 = drill 1.422 long: 1 -3.5,0; 2 0,0; 3 3.5,0
FE05-1 = drill 0.813 long: 1 -5.08,0; 2 -2.54,0; 3 0,0; 4 2.54,0; 5 5.08,0
CTS406 = smd 1.9 x 1.4: 1 -2.2,-1.2; 2 2.2,-1.2; 3 2.2,1.2; 4 -2.2,1.2
RJ45-8 = drill 1 pad 1.88 square: 1 -4.445,6.35 | drill 1 pad 1.88: 2 -3.175,8.89; 3 -1.905,6.35; 4 -0.635,8.89; 5 0.635,6.35; 6 1.905,8.89; 7 3.175,6.35; 8 4.445,8.89 | hole 3.2: -5.715,0; 5.715,0
USB-A-S-SILK-FEMALE = smd 3 x 0.9: D+ 7.212,-1; D- 7.212,1; GND 7.212,-3.5; VBUS 7.212,3.5 | drill 2.311: SHLD1 3,-6.566; SHLD2 3,6.566
2X20 = drill 1.016 pad 1.88: 1 0,0; 2 0,2.54; 3 2.54,0; 4 2.54,2.54; 5 5.08,0; 6 5.08,2.54; 7 7.62,0; 8 7.62,2.54; 9 10.16,0; 10 10.16,2.54; 11 12.7,0; 12 12.7,2.54; 13 15.24,0; 14 15.24,2.54; 15 17.78,0; 16 17.78,2.54; 17 20.32,0; 18 20.32,2.54; 19 22.86,0; 20 22.86,2.54; 21 25.4,0; 22 25.4,2.54; 23 27.94,0; 24 27.94,2.54; 25 30.48,0; 26 30.48,2.54; 27 33.02,0; 28 33.02,2.54; 29 35.56,0; 30 35.56,2.54; 31 38.1,0; 32 38.1,2.54; 33 40.64,0; 34 40.64,2.54; 35 43.18,0; 36 43.18,2.54; 37 45.72,0; 38 45.72,2.54; 39 48.26,0; 40 48.26,2.54
USB-MICROB-PTH-MILL = smd 0.4 x 1.75: D+ 0,0; D- -0.65,0; GND 1.3,0; ID 0.65,0; VBUS -1.3,0 | smd 2 x 1.46: SHIELD -2.9,0.275; SHIELD2 2.9,0.275 | smd 1.425 x 2.5: SHIELD3 -0.963,-2.675; SHIELD4 0.963,-2.675 | smd 1.4 x 2.1 bottom: SHIELD5 -2.731,-2.531; SHIELD7 2.729,-2.531 | smd 1 x 1: SHIELD6 2.7,-2.575 | smd 1.1 x 1.5: SHIELD8 -2.731,-2.731 | smd 1 x 1.3 bottom: SHIELD9 -2.43,0.195; SHIELD10 2.43,0.195
CHIP-LED0805 = smd 1.2 x 1.2: A 0,-1.05; C 0,1.05
SOT-223 = smd 1 x 2.1: 1 -2.3,-3.1; 2 0,-3.1; 3 2.3,-3.1 | smd 3.7 x 2.1: 4 0,3.1
R0603 = smd 1 x 1.1: 1 -0.85,0; 2 0.85,0
SJ_2S-NO = smd 0.635 x 1.27: 1 -0.45,0; 2 0.45,0
1X03 = drill 1.016 pad 1.88: 1 0,0; 2 2.54,0; 3 5.08,0
LQFP48-7X7MM = smd 1.194 x 0.305: 1 -4.25,2.75; 2 -4.25,2.25; 3 -4.25,1.75; 4 -4.25,1.25; 5 -4.25,0.75; 6 -4.25,0.25; 7 -4.25,-0.25; 8 -4.25,-0.75; 9 -4.25,-1.25; 10 -4.25,-1.75; 11 -4.25,-2.25; 12 -4.25,-2.75; 25 4.25,-2.75; 26 4.25,-2.25; 27 4.25,-1.75; 28 4.25,-1.25; 29 4.25,-0.75; 30 4.25,-0.25; 31 4.25,0.25; 32 4.25,0.75; 33 4.25,1.25; 34 4.25,1.75; 35 4.25,2.25; 36 4.25,2.75 | smd 0.305 x 1.194: 13 -2.75,-4.25; 14 -2.25,-4.25; 15 -1.75,-4.25; 16 -1.25,-4.25; 17 -0.75,-4.25; 18 -0.25,-4.25; 19 0.25,-4.25; 20 0.75,-4.25; 21 1.25,-4.25; 22 1.75,-4.25; 23 2.25,-4.25; 24 2.75,-4.25; 37 2.75,4.25; 38 2.25,4.25; 39 1.75,4.25; 40 1.25,4.25; 41 0.75,4.25; 42 0.25,4.25; 43 -0.25,4.25; 44 -0.75,4.25; 45 -1.25,4.25; 46 -1.75,4.25; 47 -2.25,4.25; 48 -2.75,4.25
SO-DIMM = smd 0.35 x 2: 1 -26.4,-3.9; 2 -26.1,3.9; 3 -25.8,-3.9; 4 -25.5,3.9; 5 -25.2,-3.9; 6 -24.9,3.9; 7 -24.6,-3.9; 8 -24.3,3.9; 9 -24,-3.9; 10 -23.7,3.9; 11 -23.4,-3.9; 12 -23.1,3.9; 13 -22.8,-3.9; 14 -22.5,3.9; 15 -22.2,-3.9; 16 -21.9,3.9; 17 -21.6,-3.9; 18 -21.3,3.9; 19 -21,-3.9; 20 -20.7,3.9; 21 -20.4,-3.9; 22 -20.1,3.9; 23 -19.8,-3.9; 24 -19.5,3.9; 25 -19.2,-3.9; 26 -18.9,3.9; 27 -18.6,-3.9; 28 -18.3,3.9; 29 -18,-3.9; 30 -17.7,3.9; 31 -17.4,-3.9; 32 -17.1,3.9; 33 -16.8,-3.9; 34 -16.5,3.9; 35 -16.2,-3.9; 36 -15.9,3.9; 37 -15.6,-3.9; 38 -15.3,3.9; 39 -15,-3.9; 40 -14.7,3.9; 41 -10.8,-3.9; 42 -10.5,3.9; 43 -10.2,-3.9; 44 -9.9,3.9; 45 -9.6,-3.9; 46 -9.3,3.9; 47 -9,-3.9; 48 -8.7,3.9; 49 -8.4,-3.9; 50 -8.1,3.9; 51 -7.8,-3.9; 52 -7.5,3.9; 53 -7.2,-3.9; 54 -6.9,3.9; 55 -6.6,-3.9; 56 -6.3,3.9; 57 -6,-3.9; 58 -5.7,3.9; 59 -5.4,-3.9; 60 -5.1,3.9; 61 -4.8,-3.9; 62 -4.5,3.9; 63 -4.2,-3.9; 64 -3.9,3.9; 65 -3.6,-3.9; 66 -3.3,3.9; 67 -3,-3.9; 68 -2.7,3.9; 69 -2.4,-3.9; 70 -2.1,3.9; 71 -1.8,-3.9; 72 -1.5,3.9; 73 -1.2,-3.9; 74 -0.9,3.9; 75 -0.6,-3.9; 76 -0.3,3.9; 77 0,-3.9; 78 0.3,3.9; 79 0.6,-3.9; 80 0.9,3.9; 81 1.2,-3.9; 82 1.5,3.9; 83 1.8,-3.9; 84 2.1,3.9; 85 2.4,-3.9; 86 2.7,3.9; 87 3,-3.9; 88 3.3,3.9; 89 3.6,-3.9; 90 3.9,3.9; 91 4.2,-3.9; 92 4.5,3.9; 93 4.8,-3.9; 94 5.1,3.9; 95 5.4,-3.9; 96 5.7,3.9; 97 6,-3.9; 98 6.3,3.9; 99 6.6,-3.9; 100 6.9,3.9; 101 7.2,-3.9; 102 7.5,3.9; 103 7.8,-3.9; 104 8.1,3.9; 105 8.4,-3.9; 106 8.7,3.9; 107 9,-3.9; 108 9.3,3.9; 109 9.6,-3.9; 110 9.9,3.9; 111 10.2,-3.9; 112 10.5,3.9; 113 10.8,-3.9; 114 11.1,3.9; 115 11.4,-3.9; 116 11.7,3.9; 117 12,-3.9; 118 12.3,3.9; 119 12.6,-3.9; 120 12.9,3.9; 121 13.2,-3.9; 122 13.5,3.9; 123 13.8,-3.9; 124 14.1,3.9; 125 14.4,-3.9; 126 14.7,3.9; 127 15,-3.9; 128 15.3,3.9; 129 15.6,-3.9; 130 15.9,3.9; 131 16.2,-3.9; 132 16.5,3.9; 133 16.8,-3.9; 134 17.1,3.9; 135 17.4,-3.9; 136 17.7,3.9; 137 18,-3.9; 138 18.3,3.9; 139 18.6,-3.9; 140 18.9,3.9; 141 19.2,-3.9; 142 19.5,3.9; 143 19.8,-3.9; 144 20.1,3.9; 145 20.4,-3.9; 146 20.7,3.9; 147 21,-3.9; 148 21.3,3.9; 149 21.6,-3.9; 150 21.9,3.9; 151 22.2,-3.9; 152 22.5,3.9; 153 22.8,-3.9; 154 23.1,3.9; 155 23.4,-3.9; 156 23.7,3.9; 157 24,-3.9; 158 24.3,3.9; 159 24.6,-3.9; 160 24.9,3.9; 161 25.2,-3.9; 162 25.5,3.9; 163 25.8,-3.9; 164 26.1,3.9; 165 26.4,-3.9; 166 26.7,3.9; 167 27,-3.9; 168 27.3,3.9; 169 27.6,-3.9; 170 27.9,3.9; 171 28.2,-3.9; 172 28.5,3.9; 173 28.8,-3.9; 174 29.1,3.9; 175 29.4,-3.9; 176 29.7,3.9; 177 30,-3.9; 178 30.3,3.9; 179 30.6,-3.9; 180 30.9,3.9; 181 31.2,-3.9; 182 31.5,3.9; 183 31.8,-3.9; 184 32.1,3.9; 185 32.4,-3.9; 186 32.7,3.9; 187 33,-3.9; 188 33.3,3.9; 189 33.6,-3.9; 190 33.9,3.9; 191 34.2,-3.9; 192 34.5,3.9; 193 34.8,-3.9; 194 35.1,3.9; 195 35.4,-3.9; 196 35.7,3.9; 197 36,-3.9; 198 36.3,3.9; 199 36.6,-3.9; 200 36.9,3.9 | smd 4.6 x 4.6: G1 -28.254,12; G2 39.27,12 | hole 1.6: -28.15,0 | hole 1.1: 38.65,0
DCJACK_2MM_SMT = smd 2.4 x 2: GND 0,-5.5; GNDBREAK 6.2,-5.5; PWR1 0,5.5; PWR2 6.2,5.5 | hole 1.6: 0,0 | hole 1.8: 4.5,0

### Placement (x,y rotation side)
BOOT0  23.68,23.33 180 top
C3  16.99,50.92 90 top
C4  16.99,46.92 270 top
C5  47.87,45.07 90 top
C6  43.12,35.32 0 top
C8  33.37,40.07 270 top
C9  38.62,51.32 180 top
C10  50.37,45.07 90 top
C14  51.87,52.57 270 top
C15  42.37,52.57 90 top
C16  37.87,34.32 0 top
C18  26.12,46.57 270 top
C22  38.62,53.82 180 top
CF1  32.87,51.07 180 top
CF2  29.37,51.07 180 top
CF3  25.87,51.07 180 top
CFV  22.37,51.07 180 top
CT1  113.77,1.13 180 top
CT2  126.04,1.13 180 top
CT3  77.35,1.13 180 top
CT4  101.6,1.02 180 top
CT5  89.41,1.52 180 top
CT6  19.56,2.29 180 top
CT7  137.67,1.78 180 top
CT8  65.28,1.27 180 top
CT9  8.13,2.03 180 top
CT10  30.99,1.52 180 top
CT11  42.42,1.02 180 top
CT12  53.85,1.78 180 top
DS18B20  2.43,78.15 90 top
GND  39.13,22.72 180 top
HSE  30.61,60.19 180 top
J1  142.24,38.1 90 top
J2  144.78,71.12 180 top
J3  53.34,21.59 0 top
J4  140.97,24.13 90 top
J5  142.24,53.34 90 top
LED1  30.62,36.07 90 top
LOGO1  OSHW_LOGO_6MILX0200-NT  [OSHW_6X200_NOTEXT]  68.02,20.6 0 top
MCP1825  20.18,59.08 270 top
PULSE  2.43,68.33 90 top
R1  26.87,34.32 180 top
R2  54.37,38.32 90 top
R3  34.37,36.07 0 top
R19  8.25,67.69 180 top
R20  12.25,67.69 180 top
R22  28.87,42.07 270 top
R23  28.87,46.57 270 top
RB1  42.75,66.44 0 top
RB2  31.75,66.44 0 top
RB3  20.75,66.44 0 top
RF1  32.87,54.07 180 top
RF2  29.37,54.07 180 top
RF3  25.87,54.07 180 top
RFV  22.37,54.07 180 top
SJ1  56.12,34.07 180 top
STLINK  19.95,29.01 0 top
STM32  22.71,38.64 270 top
U1  74.93,46.99 0 top
U$1  3.63,55.99 0 top
U$2  3.81,41.91 0 top
U$3  3.81,27.94 0 top

### Tracks (layer width: path | path; a pad name or v marks a point on that pad's centre or on a via)
3.3V  (1 unrouted)
5V  (1 unrouted)
+3V3  (via drill 0.6)
  Top 0.254: C4.2 5.1,47.34 MCP1825.3
  Top 0.305: STM32.9 31.62,56.56 30.15,58.04 C9.2 | STM32.36 35.62,44.06 36,43.69 36,43.29 C6.2 | STM32.48 38.88,52.81 39.25,53.19 | C5.2 39.88,53.19 40.25,53.55 | STM32.24 27.12,47.31 26.75,46.94 25.85,46.94 C8.2
  Top 0.406: MCP1825.3 5.7,47.94 8.75,47.94 14.75,41.94 v31.49,40.67 R1.2 | C8.2 25.73,46.81 v39.37,45.55 22.1,48.84 R22.2 | v43.37,59.05 28.5,60.31 29.62,61.44 C22.2 C9.2 | 40.25,53.55 v55.49,53.92 | BOOT0.2 41.46,45.23 42,44.69 44.25,44.69 47.25,41.69 SJ1.2 | 39.25,53.19 39.6,53.54 C5.2 | C6.2 36.37,42.96 36.39,42.94 v53.49,41.67
  Bottom 0.406: v31.49,40.67 16.25,41.44 17.5,40.19 22.5,40.19 | 22.5,40.19 24.5,38.19 DS18B20.3 | 22.5,40.19 32.75,40.19 | 32.75,40.19 35,37.94 PULSE.3 | 22.5,40.19 24.12,41.81 v39.37,45.55 24.12,51.81 28,55.69 28,60.19 v43.37,59.05 | 32.75,40.19 35.5,40.19 v53.49,41.67 41.46,46.15 BOOT0.2 41.25,46.19 40.25,47.19 v55.49,53.92
+5V  (via drill 0.6)
  Top 0.406: 8.62,61.81 6.62,61.81 4.75,59.94 4.75,57.69 5.75,56.69 v20.99,52.92 5.75,53.19 | MCP1825.1 5.75,52.59 5.75,53.19 | C3.2 5.6,53.04 5.75,53.19
  Bottom 0.406: 46.75,35.69 GND.3 44.75,34.69 37.25,34.69 35.5,32.94 34.5,32.94 | 34.5,32.94 16,32.94 5.75,43.19 v20.99,52.92 | 49.23,30.67 47.75,29.19 38.25,29.19 34.5,32.94
AC
  Top 0.406: R20.1 14.5,69.09 U$1.PWR2
ADC0
  Top 0.406: R19.1 R20.2 11.4,66.54 15.5,62.44 15.5,61.54 RFV.1
BIAS  (via drill 0.6)
  Top 0.305: STM32.16 30.38,51.31 v46.24,50.67
  Top 0.406: 30.75,81.19 CT2.P$1 | CT2.P$1 32.55,81.19 | CT2.P$4 37.1,65.84 37.1,68.04 37.25,68.19 | 36.25,74.69 43.75,74.69 | 43.75,74.69 47.25,74.69 48.25,73.69 48.25,68.29 CT1.P$4 47.05,66.99 | 47.05,66.99 46.5,66.44 RB1.2 | 36.25,74.69 37.25,73.69 37.25,68.29 CT2.P$4 | 36.25,74.69 32.75,74.69 | 32.75,74.69 24.75,74.69 | 24.75,74.69 21.75,74.69 20.65,75.79 | 24.75,74.69 26.1,73.34 26.1,68.14 arc-90 CT3.P$4 24.4,66.44 RB3.2 | 32.75,74.69 31.65,75.79 CT2.P$1 | 43.75,74.69 42.65,75.79 CT1.P$1 | CT2.P$4 35.4,66.44 RB2.2 32.6,65.09 v33,64.69 | 20.65,75.79 CT3.P$1 | 48.25,68.19 47.05,66.99 | U$1.GND U$1.GNDBREAK 7.4,70.09 R19.2 7.5,67.79 7.5,69.94 12,74.44 12,75.69 13.25,76.94 19.5,76.94 20.65,75.79
  Bottom 0.406: v46.24,50.67 33,53.94 v33,64.69
BIAS_IN
  Top 0.254: C18.2 R23.2 R22.1
  Top 0.305: STM32.17 20.75,50.81 R22.1
BOOT0  (via drill 0.6)
  Top 0.305: STM32.44 40.12,50.81 44,46.94 BOOT0.1 45.1,45.09 R2.1 | v54.24,35.42 39,33.36
  Bottom 0.305: BOOT0.1 40,42.19 38.75,42.19 37.5,40.94 37.5,38.19 v54.24,35.42
CT1
  Top 0.305: CF1.2 24.4,58.04 25,57.44 29.75,57.44 31.12,56.06 STM32.10
  Top 0.406: RF1.2 CF1.2
CT2
  Top 0.305: CF2.2 20.9,57.79 21.75,56.94 29.5,56.94 30.62,55.81 STM32.11
  Top 0.406: RF2.2 CF2.2
CT3
  Top 0.305: CF3.2 17.4,57.79 18.75,56.44 29.25,56.44 30.12,55.56 STM32.12
  Top 0.406: RF3.2 CF3.2
DS18B20  (via drill 0.6)
  Top 0.305: DS18B20.2 21,38.44 20.1,39.34 R1.1 v41.99,40.67 | STM32.21 27.38,48.81 v42.49,47.67
  Bottom 0.305: v42.49,47.67 27.25,42.44 v41.99,40.67
GND  (via drill 0.6)  (35 unrouted)
  Top 0.254: C18.1 R23.1 | C4.1 C3.1 3.6,51.34 4.75,50.19 MCP1825.2 7.5,50.19 8.5,51.19
  Top 0.305: C9.1 32.12,58.67 STM32.8 32.12,53.06 32.88,52.31 33,52.31 | C22.1 34.35,61.44 C15.2 | C6.1 34.75,43.04 34.75,43.69 35.12,44.06 STM32.35 35.12,46.81 33,48.94 33,49.44 | C10.1 C5.1 40.02,51.94 39.25,51.94 38.88,52.31 STM32.47 33,52.31 | C8.1 26.1,48.19 26.75,48.19 27.12,47.81 STM32.23 31.38,47.81 33,49.44 | 33,49.44 33,52.31 | PULSE.1 28,40.54 C16.1 | 41.69,33.25 41.69,33.13 40.5,31.94 37.5,31.94 | CF1.1 26.12,58.72 v41.37,58.92 | CF2.1 22.62,58.72 v37.87,58.92 | CFV.1 15.62,58.72 v30.86,58.92 | CF3.1 19.12,58.72 v34.37,58.92
  Top 0.406: C14.2 44.25,52.44 43.65,51.84 | 43.65,51.84 C10.1 | 10.3,64.64 12,62.94 v27.24,58.92 12,59.19 11.4,58.59 | 43.65,51.84 46.75,48.74 R2.2 47.9,46.79 49,45.69 v64.24,42.92 | 26.5,33.44 19.25,33.44 17.5,35.19 DS18B20.1 | 26.5,33.44 36,33.44 37.5,31.94 | PULSE.1 28,34.94 26.5,33.44 | v41.37,58.92 26.62,60.19 27.25,60.81 27.25,60.94 29.25,62.94 31.25,62.94 31.88,62.31 31.88,61.47 C22.1 C9.1
  Bottom 0.305: v27.24,58.92 v30.86,58.92 v34.37,58.92 v37.87,58.92 v41.37,58.92
  Bottom 0.406: GND.1 51.88,36.73 51.88,37.94 49,40.81 v64.24,42.92 | DS18B20.1 12,42.44 v27.24,58.92
  other vias: 62.49,58.92 32.49,48.92 49.74,46.92 40.49,53.92 41.74,50.92 29.49,44.17 66.49,46.67 16.25,65.19 16.25,73.19 17,78.94 28.75,73.19 39.75,73.19 50.75,73.19 28.5,80.69 39.5,80.69 23.74,43.17 27.24,54.17 18.49,43.17 49.74,50.42 46.49,46.92 66.49,40.42 38.24,48.42
  pour Top: 0.25,82.69 53.75,82.69 53.75,28.19 0.25,28.19
  pour Bottom: 0.25,82.69 0.25,28.19 53.75,28.19 53.75,82.69
HSE_IN
  Top 0.305: STM32.5 33.62,56.06 35,57.44 39,57.44 39.5,57.94 39.5,60.94 40,61.44 41.65,61.44 HSE.1 43.9,61.39 C14.1
HSE_OUT
  Top 0.305: STM32.6 33.12,57.72 C15.1 36.95,59.34 HSE.3
LED
  Top 0.305: STM32.27 31.12,44.31 30.5,43.69 R3.2
N$1
  Top 0.406: GND.2 49.29,41.35 SJ1.1
N$2
  Top 0.406: CT1.P$2 41.9,69.94 RB1.1 38.65,63.19 32.5,63.19 31.75,63.94 27.75,63.94 26.1,62.29 RF1.1
N$8
  Top 0.406: CT2.P$2 30.9,69.94 RB2.1 28.75,66.44 26,63.69 23.5,63.69 22.6,62.79 RF2.1
N$10
  Top 0.406: RF3.1 19.1,65.64 RB3.1 19.9,69.94 CT3.P$2
N$41
  Top 0.305: LED1.A R3.1
NRST  (via drill 0.6)
  Top 0.305: STM32.7 32.62,53.31 32.75,53.19 36,53.19 39.25,56.44 41.5,56.44 v57.99,53.92 C10.2 42.65,53.54
  Bottom 0.305: 44.27,33.21 45.75,34.69 47.25,34.69 48,35.44 48,42.19 | v57.99,53.92 48,49.94 48,42.19 | STLINK.3 46.25,40.44 48,42.19
PULSE
  Top 0.305: 31.5,41.84 C16.2 | PULSE.2 31.5,41.54 C16.2 | C16.2 31.62,42.47 STM32.28
SWCLK
  Top 0.305: STM32.37 37.12,45.81 41.54,41.4 STLINK.2
SWDIO
  Top 0.305: STM32.34 34.62,44.69 33.5,43.56 33.5,41.94 34.12,41.31 38.12,41.31 STLINK.1
UART_RX
  Top 0.305: 45.5,31.94 45.5,34.94 44.21,36.23 GND.4 44.25,36.73 44.25,37.44 43.25,38.44 38.25,38.44 36.25,40.44 34,40.44 32.88,41.56 32.88,43.94 33.12,44.19 STM32.31
UART_TX
  Top 0.305: 42.96,31.94 43,31.94 43,34.94 41.67,36.27 GND.5 40.67,37.69 38,37.69 36,39.69 33.75,39.69 32.25,41.19 32.25,44.19 32.62,44.56 STM32.30
VBUS  (1 unrouted)
VSIG
  Top 0.305: CFV.2 13.9,48.29 16.38,45.81 STM32.25
  Top 0.406: RFV.2 CFV.2

### Text on the board
tPlace: Designed in | North Wales | Made in UK
tValues: DIO | CLK | RST | emonSTM32 | v0.1 | Development Board | OpenEnergyMonitor | TX | RX | 5V | 3.3 | GND | T | 3V3 | GND | P | 3V3 | Open-Hardware | DS18B20 | PULSE INPUT